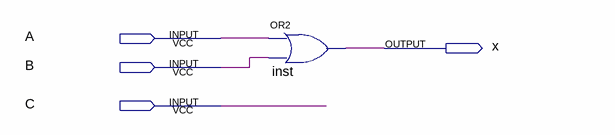
[diagram p0: schematic sheet]
// Quartus schematic circuito_logico.bdf as structural Verilog: 1 symbols, 4 pins
module circuito_logico (
  input  A,
  input  B,
  input  C,
  output x
);

  or inst (x, A, B);
endmodule
